# EAGLE schematic balise réceptrice (EAGLE 6.3)
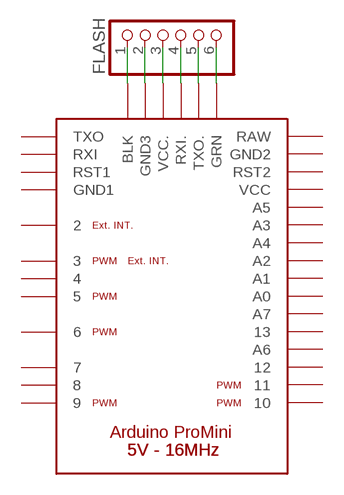
[diagram p0: schematic, sheet 1]

## Parts
FLASH  PINHD-1X6/90  [1X06/90]
U$1  ARDUINO_PRO_MINI  [ARDUINO_PRO_MINI]

## Nets
N$1: FLASH.1 U$1.BLK
N$2: FLASH.2 U$1.GND3
N$3: FLASH.3 U$1.VCC2(VCC.)
N$4: FLASH.4 U$1.RXI2(RXI.)
N$5: FLASH.5 U$1.TXO2(TXO.)
N$6: FLASH.6 U$1.GRN
Unconnected: U$1.2 U$1.3 U$1.4 U$1.5 U$1.6 U$1.7 U$1.8 U$1.9 U$1.10 U$1.11 U$1.12 U$1.13 U$1.A0 U$1.A1 U$1.A2 U$1.A3 U$1.A4 U$1.A5 U$1.A6 U$1.A7 U$1.GND1 U$1.GND2 U$1.RAW U$1.RST1 U$1.RST2 U$1.RXI1(RXI) U$1.TXO1(TXO) U$1.VCC1(VCC)

## Library data of the parts
FLASH = pinhead:PINHD-1X6: PIN HEADER
U$1 = arduino:ARDUINO_PRO_MINI